# EAGLE design MICRO_SQUARED_SENSING_MCP1700_4 (EAGLE 7.5.0)
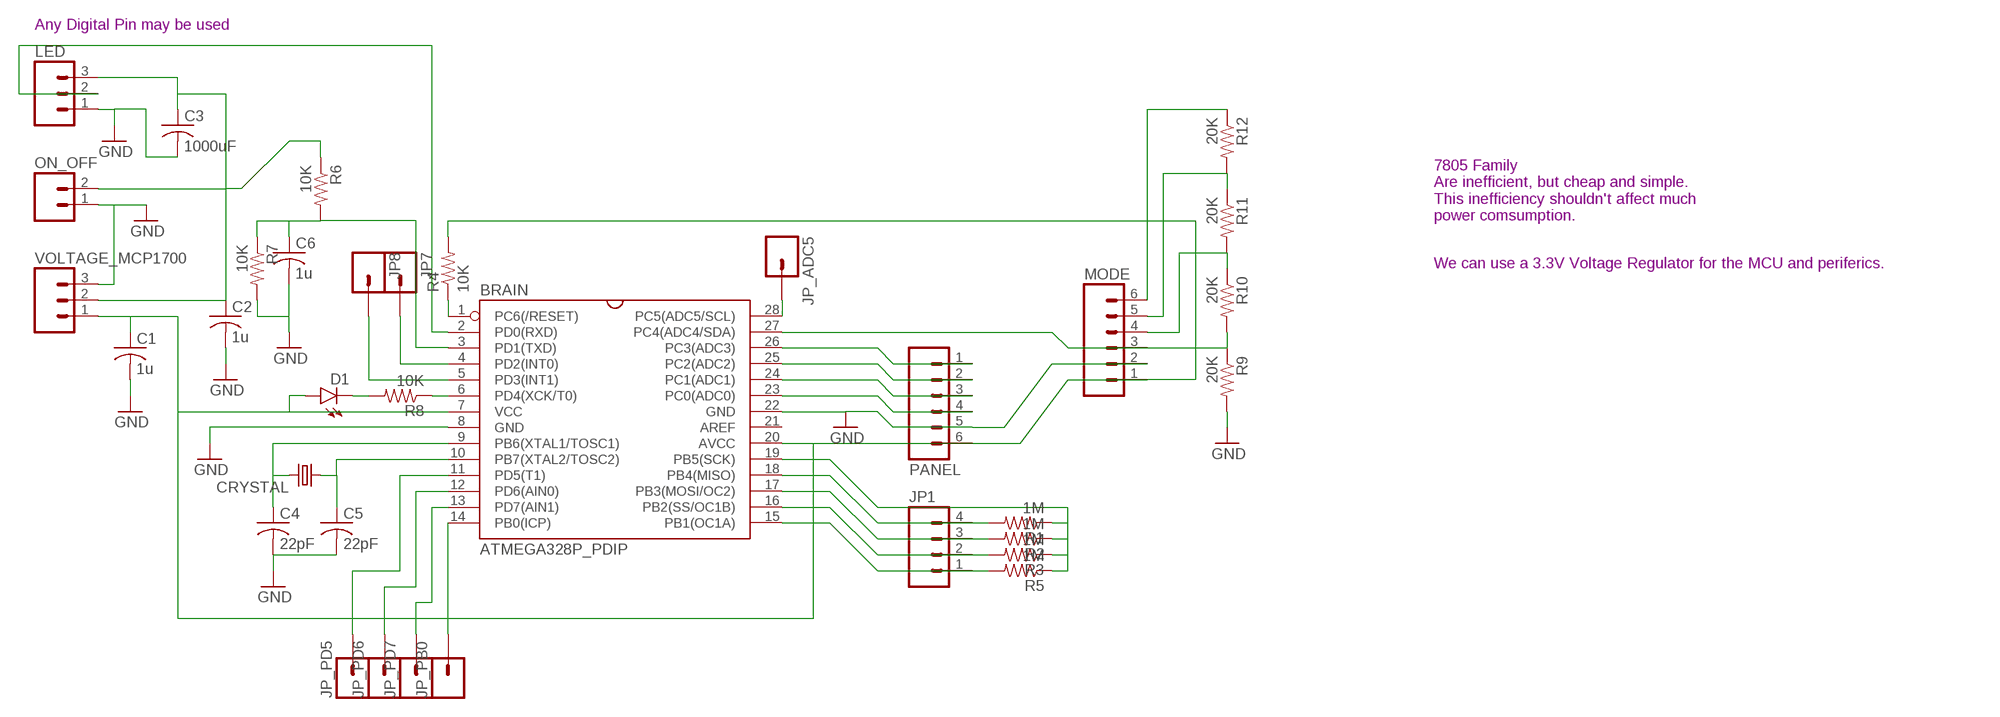
[diagram p0: schematic, sheet 1]

## Parts
BRAIN  ATMEGA328P_PDIP  [DIL-28-3]
C1  1u  C-US050-025X075  [C050-025X075]
C2  1u  C-US050-025X075  [C050-025X075]
C3  1000uF  C-US050-075X075  [C050-075X075]
C4  22pF  C-US025-024X044  [C025-024X044]
C5  22pF  C-US025-024X044  [C025-024X044]
C6  1u  C-US050-025X075  [C050-025X075]
CRYSTAL  CRYSTALHC49US  [HC49US]
D1  LED3MM  [LED3MM]
JP1  M04PTH  [1X04]
JP7  M01PTH  [1X01]
JP8  M01PTH  [1X01]
JP_ADC5  M01PTH  [1X01]
JP_PB0  M01PTH  [1X01]
JP_PD5  M01PTH  [1X01]
JP_PD6  M01PTH  [1X01]
JP_PD7  M01PTH  [1X01]
LED  M03PTH  [1X03]
MODE  M06SILK_FEMALE_PTH  [1X06]
ON_OFF  M02PTH  [1X02]
PANEL  M06NO_SILK_FEMALE_PTH  [1X06_NO_SILK]
R1  1M  RESISTORAXIAL-0.3  [AXIAL-0.3]
R2  1M  RESISTORAXIAL-0.3  [AXIAL-0.3]
R3  1M  RESISTORAXIAL-0.3  [AXIAL-0.3]
R4  10K  RESISTORAXIAL-0.3  [AXIAL-0.3]
R5  1M  RESISTORAXIAL-0.3  [AXIAL-0.3]
R6  10K  RESISTORAXIAL-0.3  [AXIAL-0.3]
R7  10K  RESISTORAXIAL-0.3  [AXIAL-0.3]
R8  10K  RESISTORAXIAL-0.3  [AXIAL-0.3]
R9  20K  RESISTORAXIAL-0.3  [AXIAL-0.3]
R10  20K  RESISTORAXIAL-0.3  [AXIAL-0.3]
R11  20K  RESISTORAXIAL-0.3  [AXIAL-0.3]
R12  20K  RESISTORAXIAL-0.3  [AXIAL-0.3]
VOLTAGE_MCP1700  M03PTH  [1X03]

## Nets
BLUE_BRAIN: BRAIN.25(PC2(ADC2)) PANEL.2
GND: BRAIN.8(GND) BRAIN.22(GND) C1.2 C2.2 C3.2 C4.2 C5.2 C6.2 LED.1 MODE.2 ON_OFF.1 PANEL.5 R7.P$2 R9.P$2 VOLTAGE_MCP1700.3
GREEN_BRAIN: BRAIN.24(PC1(ADC1)) PANEL.3
LEDS_BRAIN: BRAIN.2(PD0(RXD)) LED.2
N$1: BRAIN.3(PD1(TXD)) C6.1 R6.P$2 R7.P$1
N$2: BRAIN.15(PB1(OC1A)) JP1.1 R5.P$2
N$3: BRAIN.16(PB2(SS/OC1B)) JP1.2 R3.P$2
N$4: BRAIN.17(PB3(MOSI/OC2)) JP1.3 R2.P$2
N$5: BRAIN.18(PB4(MISO)) JP1.4 R1.P$2
N$6: BRAIN.19(PB5(SCK)) R1.P$1 R2.P$1 R3.P$1 R5.P$1
N$7: BRAIN.9(PB6(XTAL1/TOSC1)) C4.1 CRYSTAL.2
N$8: BRAIN.10(PB7(XTAL2/TOSC2)) C5.1 CRYSTAL.1
N$9: BRAIN.5(PD3(INT1)) JP8.1
N$10: D1.K(C) R8.P$2
N$11: BRAIN.6(PD4(XCK/T0)) R8.P$1
N$12: BRAIN.4(PD2(INT0)) JP7.1
N$13: BRAIN.27(PC4(ADC4/SDA)) MODE.3 R9.P$1 R10.P$2
N$14: BRAIN.12(PD6(AIN0)) JP_PD6.1
N$15: BRAIN.13(PD7(AIN1)) JP_PD7.1
N$16: BRAIN.14(PB0(ICP)) JP_PB0.1
N$17: BRAIN.28(PC5(ADC5/SCL)) JP_ADC5.1
N$18: BRAIN.11(PD5(T1)) JP_PD5.1
N$19: MODE.6 R12.P$1
N$20: MODE.5 R11.P$1 R12.P$2
N$21: MODE.4 R10.P$1 R11.P$2
RED_BRAIN: BRAIN.26(PC3(ADC3)) PANEL.1
RST: BRAIN.1(PC6(/RESET)) R4.P$1
SPEED_BRAIN: BRAIN.23(PC0(ADC0)) PANEL.4
SWITCH_BRAIN: C2.1 C3.1 LED.3 ON_OFF.2 R6.P$1 VOLTAGE_MCP1700.2
V_5V: BRAIN.7(VCC) BRAIN.20(AVCC) C1.1 D1.A MODE.1 PANEL.6 R4.P$2 VOLTAGE_MCP1700.1
Unconnected: BRAIN.21(AREF)

## Notes on the sheet
- Any Digital Pin may be used
- 7805 Family
  Are inefficient, but cheap and simple.
  This inefficiency shouldn't affect much
  power comsumption.
- We can use a 3.3V Voltage Regulator for the MCU and periferics.

## Library data of the parts
BRAIN = RodrigoMarques_Parts:ATMEGA328P_PDIP: uC used in the Arduino 32kb flash, 1k EEPROM, 2k SRAM This is the through-hole version of this chip.
C1-C6 = adafruit:C-US: CAPACITOR, American symbol
CRYSTAL = SparkFun-FreqCtrl:CRYSTAL: Various standard crystals. Proven footprints.
D1 = SparkFun-LED:LED: LEDs Standard schematic elements and footprints for 5mm, 3mm, 1206, and 0603 sized LEDs. 5mm - Spark Fun Electronics SKU : COM-00529 (and others)
JP1 = SparkFun-Connectors:M04: Header 4 Standard 4-pin 0.1" header. Use with straight break away headers (SKU : PRT-00116), right angle break away headers (PRT-00553), swiss pins (PRT-00743), machine pins (PRT-00117), and female headers (PRT-00115). Molex polarized connector foot print use with SKU : PRT-08231 with associated crimp pins and housings. 1MM SMD Version SKU: PRT-10208
JP7 JP8 JP_ADC5 JP_PB0 JP_PD5-JP_PD7 = SparkFun-Connectors:M01: Header 1 Standard 1-pin 0.1" header. Use with straight break away headers (SKU : PRT-00116), right angle break away headers (PRT-00553), swiss pins (PRT-00743), machine pins (PRT-00117), and female headers (PRT-00115). SMTSO-256-ET is a "flush mount" nut for a 4-40 screw. The older package used to be too tight, and did not allow it to sit properly thru the drill hit. The latest (0.165DIA) fits nice and snug.
LED VOLTAGE_MCP1700 = SparkFun-Connectors:M03: Header 3 Standard 3-pin 0.1" header. Use with straight break away headers (SKU : PRT-00116), right angle break away headers (PRT-00553), swiss pins (PRT-00743), machine pins (PRT-00117), and female headers (PRT-00115). Molex polarized connector foot print use with SKU : PRT-08232 with associated crimp pins and housings.
MODE PANEL = SparkFun-Connectors:M06: Header 6 Standard 6-pin 0.1" header. Use with straight break away headers (SKU : PRT-00116), right angle break away headers (PRT-00553), swiss pins (PRT-00743), machine pins (PRT-00117), and female headers (PRT-00115). Molex polarized connector foot print use with SKU : PRT-08094 with associated crimp pins and housings. NOTES ON THE VARIANTS LOCK and LOCK_LONGPADS... This footprint was designed to help hold the alignment of a through-hole component (i.e. 6-pin header) while soldering it into place. You may notice that each hole has been shifted either up or down by 0.005 of an inch from it's more standard position (which is a perfectly straight line). This slight alteration caused the pins (the squares in the middle) to touch the edges of the holes. Because they are alternating, it causes a "brace" to hold the component in place. 0.005 has proven to be the perfect amount of "off-center" position when using our standard breakaway headers. Although looks a little odd when you look at the bare footprint, once you have a header in there, the alteration is very hard to notice. Also,if you push a header all the way into place, it is covered up entirely on the bottom side. This idea of altering the position of holes to aid alignment will be further integrated into the Sparkfun Library for other footprints. It can help hold any component with 3 or more connection pins.; PROD_ID: CONN-08437
ON_OFF = SparkFun-Connectors:M02: Standard 2-pin 0.1" header. Use with - straight break away headers ( PRT-00116) - right angle break away headers (PRT-00553) - swiss pins (PRT-00743) - machine pins (PRT-00117) - female headers (PRT-00115) Molex polarized connector foot print use with: PRT-08233 with associated crimp pins and housings. 2.54_SCREWTERM for use with PRT-10571. 3.5mm Screw Terminal footprints for PRT-08084 5mm Screw Terminal footprints for use with PRT-08432
R1-R12 = SparkFun-Passives:RESISTOR: Resistor Basic schematic elements and footprints for 0603, 1206, and PTH resistors.

## Net classes
0 default: width 0.254 mm

## Board
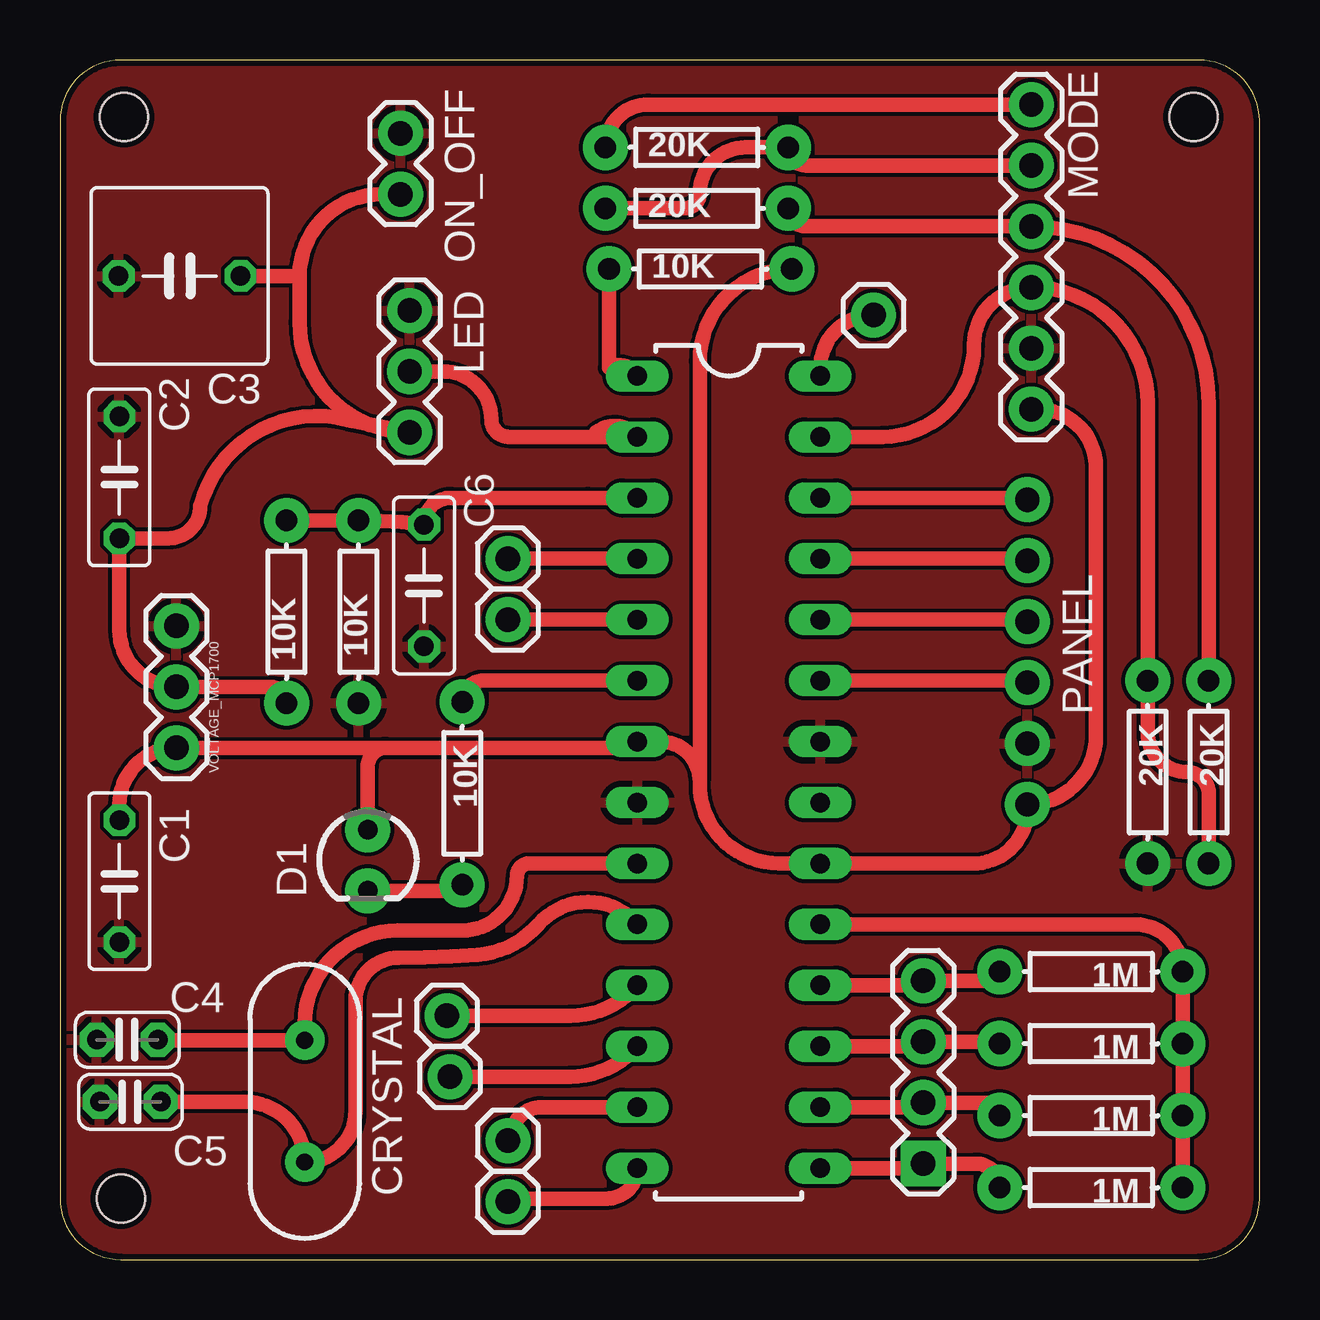
[diagram p1: board, top side]
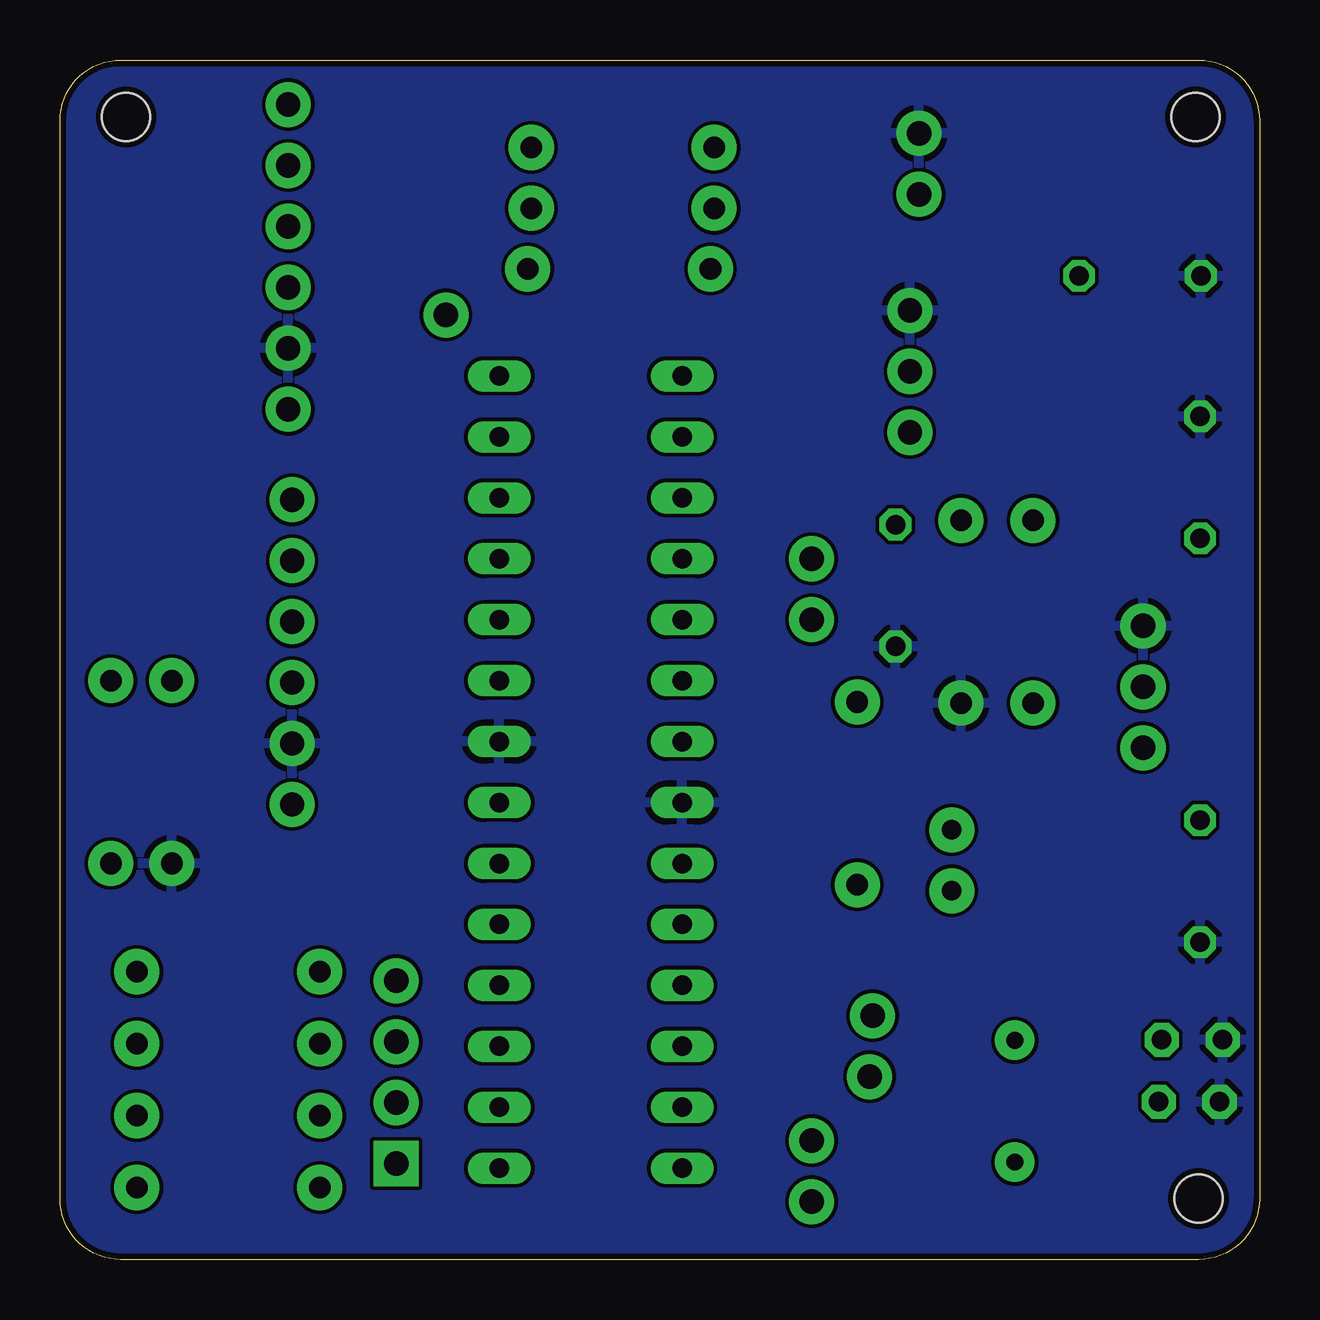
[diagram p2: board, bottom side, seen from below]

Size 50 x 50 mm. Coordinates in mm from the lower left corner, seen from the top.
Outline: 0,47.46 0,2.54 arc90 2.54,0 47.46,0 arc90 50,2.54 50,47.46 arc90 47.46,50 2.54,50 arc90 0,47.46
Copper layers (1*16): Top 0.035mm / dielectric 1.5mm / Bottom 0.035mm
Design rules "seeedstudio_2l": minimum track width 6mil, minimum drill 12mil, track to track 6mil, track to pad 6mil, pad to pad 6mil, via to via 6mil, smd to smd 0mil, copper to edge 10mil, drill to drill 10mil, minimum pad ring 10mil, minimum via ring 6mil, stop-mask expansion 2mil, vias tented up to drill 100mil, thermal gap 10mil
Holes 2 mm at 2.54,2.54 2.67,47.62 47.24,47.62

### Footprints (pad centres in the part's own frame; a part is rotated, then mirrored left to right if it is on the bottom)
DIL-28-3 = drill 0.813 long: 1 -16.51,-3.81; 2 -13.97,-3.81; 3 -11.43,-3.81; 4 -8.89,-3.81; 5 -6.35,-3.81; 6 -3.81,-3.81; 7 -1.27,-3.81; 8 1.27,-3.81; 9 3.81,-3.81; 10 6.35,-3.81; 11 8.89,-3.81; 12 11.43,-3.81; 13 13.97,-3.81; 14 16.51,-3.81; 15 16.51,3.81; 16 13.97,3.81; 17 11.43,3.81; 18 8.89,3.81; 19 6.35,3.81; 20 3.81,3.81; 21 1.27,3.81; 22 -1.27,3.81; 23 -3.81,3.81; 24 -6.35,3.81; 25 -8.89,3.81; 26 -11.43,3.81; 27 -13.97,3.81; 28 -16.51,3.81
C050-025X075 = drill 0.813 octagon: 1 -2.54,0; 2 2.54,0
C050-075X075 = drill 0.813 octagon: 1 -2.54,0; 2 2.54,0
C025-024X044 = drill 0.813 pad 1.422 octagon: 1 -1.27,0; 2 1.27,0
HC49US = drill 0.7 pad 1.651: 1 -2.54,0; 2 2.54,0
LED3MM = drill 0.813 pad 1.88: A -1.27,0; K 1.27,0
1X04 = drill 1.016 pad 1.88 square: 1 0,0 | drill 1.016 pad 1.88: 2 2.54,0; 3 5.08,0; 4 7.62,0
1X01 = drill 1.016 pad 1.88: 1 0,0
1X03 = drill 1.016 pad 1.88: 1 0,0; 2 2.54,0; 3 5.08,0
1X06 = drill 1.016 pad 1.88: 1 0,0; 2 2.54,0; 3 5.08,0; 4 7.62,0; 5 10.16,0; 6 12.7,0
1X02 = drill 1.016 pad 1.88: 1 0,0; 2 2.54,0
1X06_NO_SILK = drill 1.016 pad 1.88: 1 0,0; 2 2.54,0; 3 5.08,0; 4 7.62,0; 5 10.16,0; 6 12.7,0
AXIAL-0.3 = drill 0.9 pad 1.88: P$1 -3.81,0; P$2 3.81,0

### Placement (x,y rotation side)
BRAIN  27.88,20.32 270 top
C1  2.48,15.77 270 top
C2  2.47,32.6 90 top
C3  4.98,41 180 top
C4  2.8,9.16 180 top
C5  2.93,6.57 180 top
C6  15.17,28.09 270 top
CRYSTAL  10.2,6.6 90 top
D1  12.83,16.64 270 top
JP1  35.98,4 90 top
JP7  18.67,29.21 0 top
JP8  18.67,26.67 0 top
JP_ADC5  33.91,39.37 0 top
JP_PB0  18.67,2.41 0 top
JP_PD5  16.13,10.16 0 top
JP_PD6  16.26,7.62 0 top
JP_PD7  18.67,4.95 0 top
LED  14.57,39.56 270 top
MODE  40.49,35.44 90 top
ON_OFF  14.19,46.94 270 top
PANEL  40.32,31.67 270 top
R1  42.98,12 180 top
R2  42.98,9 180 top
R3  42.98,6 180 top
R4  26.69,41.29 0 top
R5  42.98,3 180 top
R6  9.44,27 90 top
R7  12.44,27 270 top
R8  16.76,19.43 270 top
R9  45.34,20.32 270 top
R10  47.88,20.32 270 top
R11  26.54,43.81 0 top
R12  26.54,46.35 0 top
VOLTAGE_MCP1700  4.85,21.33 90 top

### Tracks (layer width: path | path; a pad name or v marks a point on that pad's centre or on a via)
BLUE_BRAIN
  Top 0.61: BRAIN.25 40.24,29.21 arc-90 PANEL.2
GND
  pour Bottom: -9,58 -9,-9 60,-9 60,58
  pour Top: -5,54 -5,-5 56,-5 56,55 -5,55
GREEN_BRAIN
  Top 0.61: BRAIN.24 40.24,26.67 arc-90 PANEL.3
LEDS_BRAIN
  Top 0.61: 22.35,34.48 arc-90 BRAIN.2 18.69,34.29 arc-90 17.98,35 arc90 15.96,37.02 LED.2
N$1
  Top 0.61: R6.P$2 R7.P$1 arc-7 C6.1 arc-90 16.29,31.75 BRAIN.3 22,31.75
N$2
  Top 0.61: BRAIN.15 35.79,3.81 arc90 JP1.1 38.17,4 arc-90 R5.P$2
N$3
  Top 0.61: BRAIN.16 35.79,6.35 arc90 JP1.2 38.63,6.54 arc-90 R3.P$2
N$4
  Top 0.61: BRAIN.17 35.79,8.89 arc90 JP1.3 39.09,9.08 arc-90 R2.P$2
N$5
  Top 0.61: BRAIN.18 35.79,11.43 arc90 JP1.4 38.79,11.62 arc90 R1.P$2
N$6
  Top 0.61: BRAIN.19 44.82,13.97 arc-90 R1.P$1 R2.P$1 R3.P$1 R5.P$1
N$7
  Top 0.406: C4.1 arc90 4.09,9.14
  Top 0.61: 4.09,9.14 CRYSTAL.2 10.2,9.82 arc-90 14.1,13.72 16.76,13.72 arc90 19.05,16 arc-90 19.56,16.51 BRAIN.9
N$8
  Top 0.61: BRAIN.10 arc97 19.94,13.97 arc-44 17.4,12.7 arc-4 14.1,12.57 arc90 12.32,10.79 12.32,6.17 arc-90 CRYSTAL.1 arc90 7.69,6.57 C5.1
N$9
  Top 0.61: JP8.1 BRAIN.5
N$10
  Top 0.61: D1.K 16.51,15.37 arc90 R8.P$2
N$11
  Top 0.61: R8.P$1 arc-90 17.65,24.13 BRAIN.6
N$12
  Top 0.61: JP7.1 BRAIN.4
N$13
  Top 0.61: R10.P$2 47.88,19.43 arc90 46.99,20.32 arc-90 45.34,21.97 R9.P$1 45.34,35.67 arc90 MODE.3 arc90 38.1,38.13 38.1,38.1 arc-90 34.29,34.29 BRAIN.27
N$14
  Top 0.61: JP_PD6.1 21.27,7.62 arc49 BRAIN.12
N$15
  Top 0.61: JP_PD7.1 arc-90 18.8,5.08 arc-90 20.07,6.35 BRAIN.13
N$16
  Top 0.61: JP_PB0.1 arc-90 18.8,2.54 22.8,2.54 arc90 BRAIN.14
N$17
  Top 0.61: BRAIN.28 31.69,37.15 arc-90 JP_ADC5.1
N$18
  Top 0.61: JP_PD5.1 21.27,10.16 arc49 BRAIN.11
N$19
  Top 0.61: R12.P$1 arc-90 24.52,48.14 MODE.6
N$20
  Top 0.61: MODE.5 31.11,45.6 arc-90 R12.P$2 28.57,46.35 arc90 26.67,44.45 arc-90 26.04,43.81 R11.P$1
N$21
  Top 0.61: R10.P$1 47.88,35.67 arc90 MODE.4 31.11,43.06 arc-90 R11.P$2
RED_BRAIN
  Top 0.61: BRAIN.26 40.24,31.75 arc-90 PANEL.1
RST
  Top 0.61: R4.P$1 22.88,37.17 arc-90 BRAIN.1
SPEED_BRAIN
  Top 0.61: BRAIN.23 40.24,24.13 arc-90 PANEL.4
SWITCH_BRAIN
  Top 0.61: ON_OFF.2 13.38,44.4 arc90 9.98,41 | C3.1 9.98,41 | 9.98,41 9.98,39.07 arc90 LED.3 11.98,35 arc90 5.85,31.41 arc-90 4.5,30.06 C2.1 2.47,26.25 arc90 VOLTAGE_MCP1700.2 8.76,23.87 arc-90 R6.P$1
V_5V
  Top 0.61: BRAIN.7 24.39,21.59 | 13.59,21.33 VOLTAGE_MCP1700.1 arc90 2.48,18.95 C1.1 | 13.59,21.33 23.81,21.33 arc90 BRAIN.7 | D1.A 12.83,20.57 arc-90 13.59,21.33 | 26.67,19.94 26.67,19.81 arc90 29.97,16.51 BRAIN.20 38.24,16.51 arc90 PANEL.6 arc90 43.18,21.83 43.18,33.02 arc90 40.76,35.44 MODE.1 | 26.67,19.94 arc90 25.02,21.59 BRAIN.7 | R4.P$2 arc90 26.67,37.46 26.67,19.94